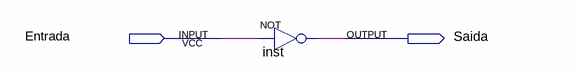
[diagram p0: schematic sheet]
// Quartus schematic Inversor.bdf as structural Verilog: 1 symbols, 2 pins
module Inversor (
  input  Entrada,
  output Saida
);

  not inst (Saida, Entrada);
endmodule
